# Altium schematic sheet Limit Switches.SchDoc
size A4; SheetNumber: 3; SheetTotal: 4
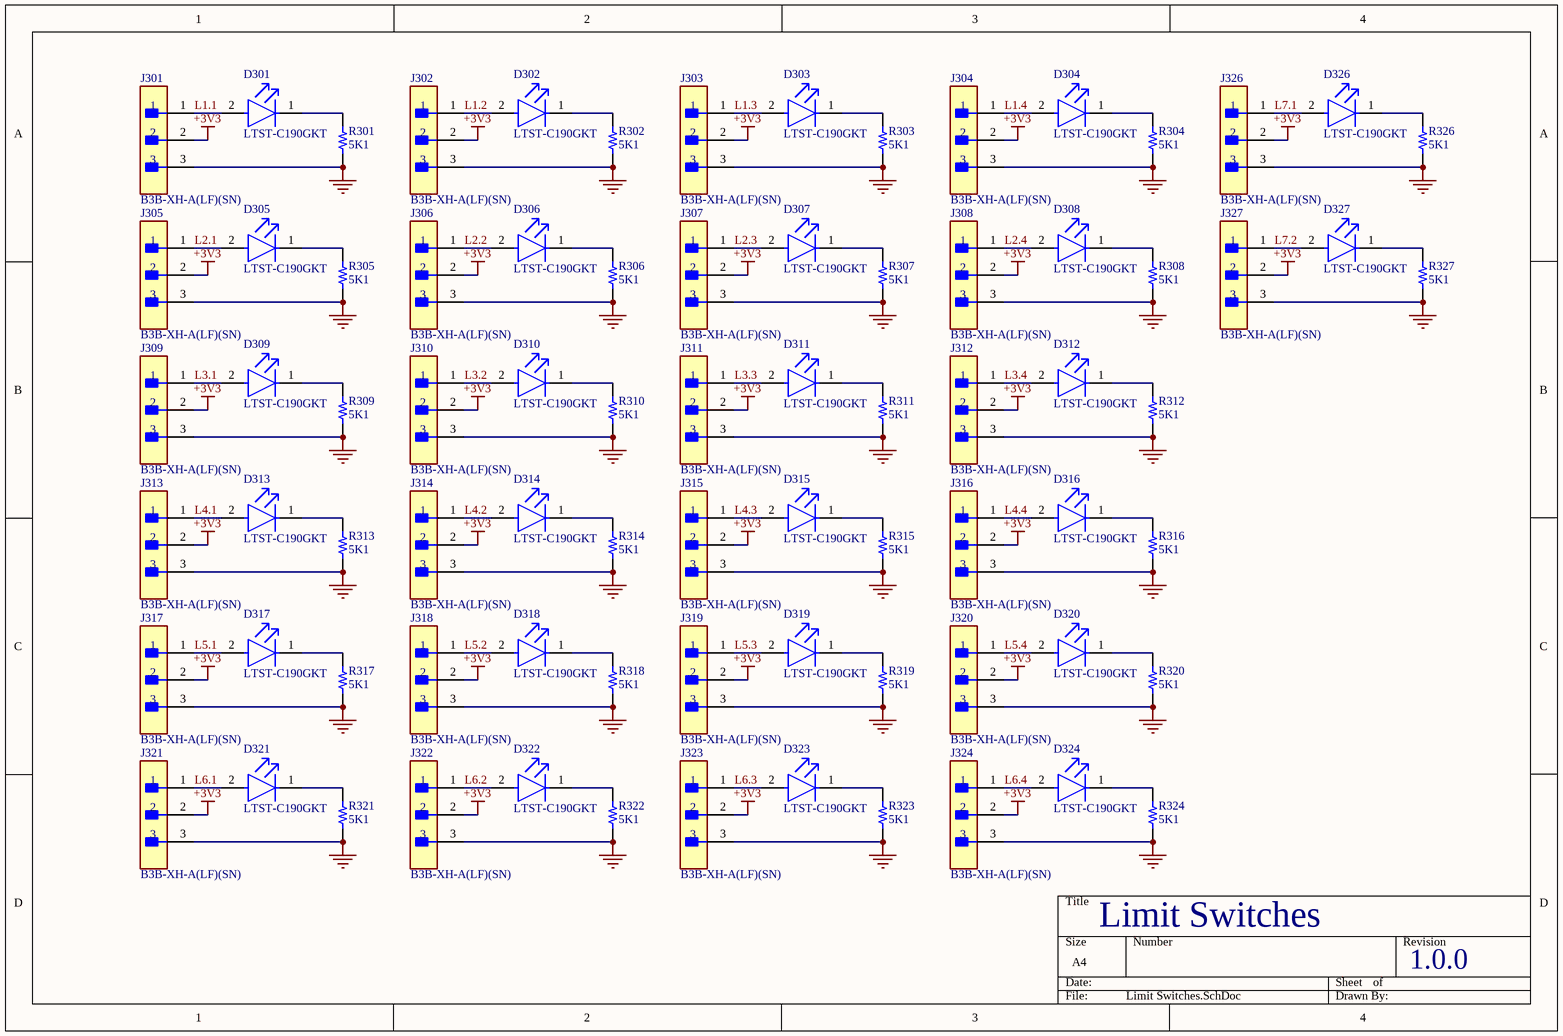
[diagram p0: Limit Switches.SchDoc]

## Parts
D301  LTST-C190GKT  [FP-LTST-C190GKT-MFG]
D302  LTST-C190GKT  [FP-LTST-C190GKT-MFG]
D303  LTST-C190GKT  [FP-LTST-C190GKT-MFG]
D304  LTST-C190GKT  [FP-LTST-C190GKT-MFG]
D305  LTST-C190GKT  [FP-LTST-C190GKT-MFG]
D306  LTST-C190GKT  [FP-LTST-C190GKT-MFG]
D307  LTST-C190GKT  [FP-LTST-C190GKT-MFG]
D308  LTST-C190GKT  [FP-LTST-C190GKT-MFG]
D309  LTST-C190GKT  [FP-LTST-C190GKT-MFG]
D310  LTST-C190GKT  [FP-LTST-C190GKT-MFG]
D311  LTST-C190GKT  [FP-LTST-C190GKT-MFG]
D312  LTST-C190GKT  [FP-LTST-C190GKT-MFG]
D313  LTST-C190GKT  [FP-LTST-C190GKT-MFG]
D314  LTST-C190GKT  [FP-LTST-C190GKT-MFG]
D315  LTST-C190GKT  [FP-LTST-C190GKT-MFG]
D316  LTST-C190GKT  [FP-LTST-C190GKT-MFG]
D317  LTST-C190GKT  [FP-LTST-C190GKT-MFG]
D318  LTST-C190GKT  [FP-LTST-C190GKT-MFG]
D319  LTST-C190GKT  [FP-LTST-C190GKT-MFG]
D320  LTST-C190GKT  [FP-LTST-C190GKT-MFG]
D321  LTST-C190GKT  [FP-LTST-C190GKT-MFG]
D322  LTST-C190GKT  [FP-LTST-C190GKT-MFG]
D323  LTST-C190GKT  [FP-LTST-C190GKT-MFG]
D324  LTST-C190GKT  [FP-LTST-C190GKT-MFG]
D326  LTST-C190GKT  [FP-LTST-C190GKT-MFG]
D327  LTST-C190GKT  [FP-LTST-C190GKT-MFG]
J301  B3B-XH-A(LF)(SN)  [FP-B3B-XH-A_LF_SN-MFG]
J302  B3B-XH-A(LF)(SN)  [FP-B3B-XH-A_LF_SN-MFG]
J303  B3B-XH-A(LF)(SN)  [FP-B3B-XH-A_LF_SN-MFG]
J304  B3B-XH-A(LF)(SN)  [FP-B3B-XH-A_LF_SN-MFG]
J305  B3B-XH-A(LF)(SN)  [FP-B3B-XH-A_LF_SN-MFG]
J306  B3B-XH-A(LF)(SN)  [FP-B3B-XH-A_LF_SN-MFG]
J307  B3B-XH-A(LF)(SN)  [FP-B3B-XH-A_LF_SN-MFG]
J308  B3B-XH-A(LF)(SN)  [FP-B3B-XH-A_LF_SN-MFG]
J309  B3B-XH-A(LF)(SN)  [FP-B3B-XH-A_LF_SN-MFG]
J310  B3B-XH-A(LF)(SN)  [FP-B3B-XH-A_LF_SN-MFG]
J311  B3B-XH-A(LF)(SN)  [FP-B3B-XH-A_LF_SN-MFG]
J312  B3B-XH-A(LF)(SN)  [FP-B3B-XH-A_LF_SN-MFG]
J313  B3B-XH-A(LF)(SN)  [FP-B3B-XH-A_LF_SN-MFG]
J314  B3B-XH-A(LF)(SN)  [FP-B3B-XH-A_LF_SN-MFG]
J315  B3B-XH-A(LF)(SN)  [FP-B3B-XH-A_LF_SN-MFG]
J316  B3B-XH-A(LF)(SN)  [FP-B3B-XH-A_LF_SN-MFG]
J317  B3B-XH-A(LF)(SN)  [FP-B3B-XH-A_LF_SN-MFG]
J318  B3B-XH-A(LF)(SN)  [FP-B3B-XH-A_LF_SN-MFG]
J319  B3B-XH-A(LF)(SN)  [FP-B3B-XH-A_LF_SN-MFG]
J320  B3B-XH-A(LF)(SN)  [FP-B3B-XH-A_LF_SN-MFG]
J321  B3B-XH-A(LF)(SN)  [FP-B3B-XH-A_LF_SN-MFG]
J322  B3B-XH-A(LF)(SN)  [FP-B3B-XH-A_LF_SN-MFG]
J323  B3B-XH-A(LF)(SN)  [FP-B3B-XH-A_LF_SN-MFG]
J324  B3B-XH-A(LF)(SN)  [FP-B3B-XH-A_LF_SN-MFG]
J326  B3B-XH-A(LF)(SN)  [FP-B3B-XH-A_LF_SN-MFG]
J327  B3B-XH-A(LF)(SN)  [FP-B3B-XH-A_LF_SN-MFG]
R301  5K1  [RES 0402_1005]
R302  5K1  [RES 0402_1005]
R303  5K1  [RES 0402_1005]
R304  5K1  [RES 0402_1005]
R305  5K1  [RES 0402_1005]
R306  5K1  [RES 0402_1005]
R307  5K1  [RES 0402_1005]
R308  5K1  [RES 0402_1005]
R309  5K1  [RES 0402_1005]
R310  5K1  [RES 0402_1005]
R311  5K1  [RES 0402_1005]
R312  5K1  [RES 0402_1005]
R313  5K1  [RES 0402_1005]
R314  5K1  [RES 0402_1005]
R315  5K1  [RES 0402_1005]
R316  5K1  [RES 0402_1005]
R317  5K1  [RES 0402_1005]
R318  5K1  [RES 0402_1005]
R319  5K1  [RES 0402_1005]
R320  5K1  [RES 0402_1005]
R321  5K1  [RES 0402_1005]
R322  5K1  [RES 0402_1005]
R323  5K1  [RES 0402_1005]
R324  5K1  [RES 0402_1005]
R326  5K1  [RES 0402_1005]
R327  5K1  [RES 0402_1005]

## Nets
+3V3: J301.2 J302.2 J303.2 J304.2 J305.2 J306.2 J307.2 J308.2 J309.2 J310.2 J311.2 J312.2 J313.2 J314.2 J315.2 J316.2 J317.2 J318.2 J319.2 J320.2 J321.2 J322.2 J323.2 J324.2 J326.2 J327.2
GND: J301.3 J302.3 J303.3 J304.3 J305.3 J306.3 J307.3 J308.3 J309.3 J310.3 J311.3 J312.3 J313.3 J314.3 J315.3 J316.3 J317.3 J318.3 J319.3 J320.3 J321.3 J322.3 J323.3 J324.3 J326.3 J327.3 R301.1 R302.1 R303.1 R304.1 R305.1 R306.1 R307.1 R308.1 R309.1 R310.1 R311.1 R312.1 R313.1 R314.1 R315.1 R316.1 R317.1 R318.1 R319.1 R320.1 R321.1 R322.1 R323.1 R324.1 R326.1 R327.1
L1.1: D301.2(A) J301.1
L1.2: D302.2(A) J302.1
L1.3: D303.2(A) J303.1
L1.4: D304.2(A) J304.1
L2.1: D305.2(A) J305.1
L2.2: D306.2(A) J306.1
L2.3: D307.2(A) J307.1
L2.4: D308.2(A) J308.1
L3.1: D309.2(A) J309.1
L3.2: D310.2(A) J310.1
L3.3: D311.2(A) J311.1
L3.4: D312.2(A) J312.1
L4.1: D313.2(A) J313.1
L4.2: D314.2(A) J314.1
L4.3: D315.2(A) J315.1
L4.4: D316.2(A) J316.1
L5.1: D317.2(A) J317.1
L5.2: D318.2(A) J318.1
L5.3: D319.2(A) J319.1
L5.4: D320.2(A) J320.1
L6.1: D321.2(A) J321.1
L6.2: D322.2(A) J322.1
L6.3: D323.2(A) J323.1
L6.4: D324.2(A) J324.1
L7.1: D326.2(A) J326.1
L7.2: D327.2(A) J327.1
NetD301_1: D301.1(C) R301.2
NetD302_1: D302.1(C) R302.2
NetD303_1: D303.1(C) R303.2
NetD304_1: D304.1(C) R304.2
NetD305_1: D305.1(C) R305.2
NetD306_1: D306.1(C) R306.2
NetD307_1: D307.1(C) R307.2
NetD308_1: D308.1(C) R308.2
NetD309_1: D309.1(C) R309.2
NetD310_1: D310.1(C) R310.2
NetD311_1: D311.1(C) R311.2
NetD312_1: D312.1(C) R312.2
NetD313_1: D313.1(C) R313.2
NetD314_1: D314.1(C) R314.2
NetD315_1: D315.1(C) R315.2
NetD316_1: D316.1(C) R316.2
NetD317_1: D317.1(C) R317.2
NetD318_1: D318.1(C) R318.2
NetD319_1: D319.1(C) R319.2
NetD320_1: D320.1(C) R320.2
NetD321_1: D321.1(C) R321.2
NetD322_1: D322.1(C) R322.2
NetD323_1: D323.1(C) R323.2
NetD324_1: D324.1(C) R324.2
NetD326_1: D326.1(C) R326.2
NetD327_1: D327.1(C) R327.2

## Notes on the sheet
- Limit Switches
- 1.0.0

## Library data of the parts
D301-D324 D326 D327 = CMP-22017-000005-2: LED GREEN CLEAR CHIP SMD; Dominant Wavelength: 569nm; Reverse Voltage: 5V; Lens Color: Colorless; Viewing Angle: 130°; Voltage: 2V; Forward Current: 30mA; Power Dissipation: 100mW; Luminous Intensity: 6mcd; Number of LEDs: 1; Forward Voltage: 2.1V; Wavelength: 565nm; Test Current: 10mA; Min Operating Temperature: -55°C; Lens Style: Clear; Mount: Surface Mount; Width: 0.8mm; Packaging: Tape and Reel; Lens Transparency: Clear; Case Code (Metric): 1608; Depth: 0.8mm; Case Code (Imperial): 0603; Case/Package: 0603; Number of Pins: 2; Max Operating Temperature: 85°C; Lead Free: Lead Free; Number of Elements: 1; Length: 1.6mm; Height: 0.8mm; Package Quantity: 1; Power Rating: 100mW; Radiation Hardening: No; Illumination Color: Green; Color: Green
J301-J324 J326 J327 = CMP-17439-000014-3: CONN HEADER VERT 3POS 2.5MM; Max Voltage Rating (DC): 250V; Number of Positions: 3; Current Rating: 3A; Gender: Male; Wire/Cable Gauge: 22AWG; Contact Resistance: 20mR; Insulation Resistance: 1GR; Insulation Material: Nylon; Contact Plating: Tin; Depth: 5.75mm; Contact Type: Male Pin; Max Operating Temperature: 85°C; Insulation Color: Natural; Voltage Rating (AC): 250V; Color: Natural; Connector Type: Header; Orientation: Straight; Fastening Type: Detent; Housing Color: White; Min Operating Temperature: -25°C; Termination: Solder; Voltage Rating: 250V; Series: XH; Pitch: 2.5mm; Contact Shape: Square; Number of Rows: 1; Lead Free: Lead Free; Packaging: Bulk; Mount: Through Hole; Flammability Rating: UL94 V-0; Max Voltage Rating (AC): 250V; REACH SVHC: No SVHC; Housing Material: Polyamide; Contact Material: Brass; Lead Pitch: 2.5mm; Contact Finish - Mating: TIN; Length: 9.9mm; Max Current Rating: 3A; Number of Contacts: 3
R301-R324 R326 R327 = AC0402JR-075K1L: RES SMD 5.1K OHM 5% 1/16W 0402; Manufacturer: Yageo; Power (Watts): 0.063W, 1/16W; Resistance: 5.1 kOhms; Temperature Coefficient: ±100ppm/°C; Part Number: AC0402JR-075K1L; Value: 5K1; ComponentLink1Description: Datasheet; ComponentLink1URL: https://www.yageo.com/upload/media/product/productsearch/datasheet/rchip/PYu-AC_51_RoHS_L_7.pdf; ComponentLink2Description: DigiKey Link; ComponentLink2URL: https://www.digikey.com/en/products/detail/yageo/AC0402JR-075K1L/5895695; Composition: Thick Film; Device Package: 0402 (1005 Metric); Features: Automotive AEC-Q200, Moisture Resistant; Height - Seated (Max): 0.015" (0.37mm); LastUpdated: 9/02/2024 8:30:14 PM; Lifecycle Status: Active; Minimum Order: 1; Number of Terminations: 2; Operating Temperature: -55°C ~ 155°C; Package / Case: 0402 (1005 Metric); Packaging: CutTape; PartId: 4690; Part Status: Active; Price: 0.01; Ratings: AEC-Q200; Series: AC; Size / Dimension: 0.039" L x 0.020" W (1.00mm x 0.50mm); Supplier 1: DigiKey; Supplier Part Number 1: YAG3554CT-ND; Supplier Device Package: 0402; Tolerance: ±5%